# EAGLE design motor_controller (EAGLE 9.3.0)
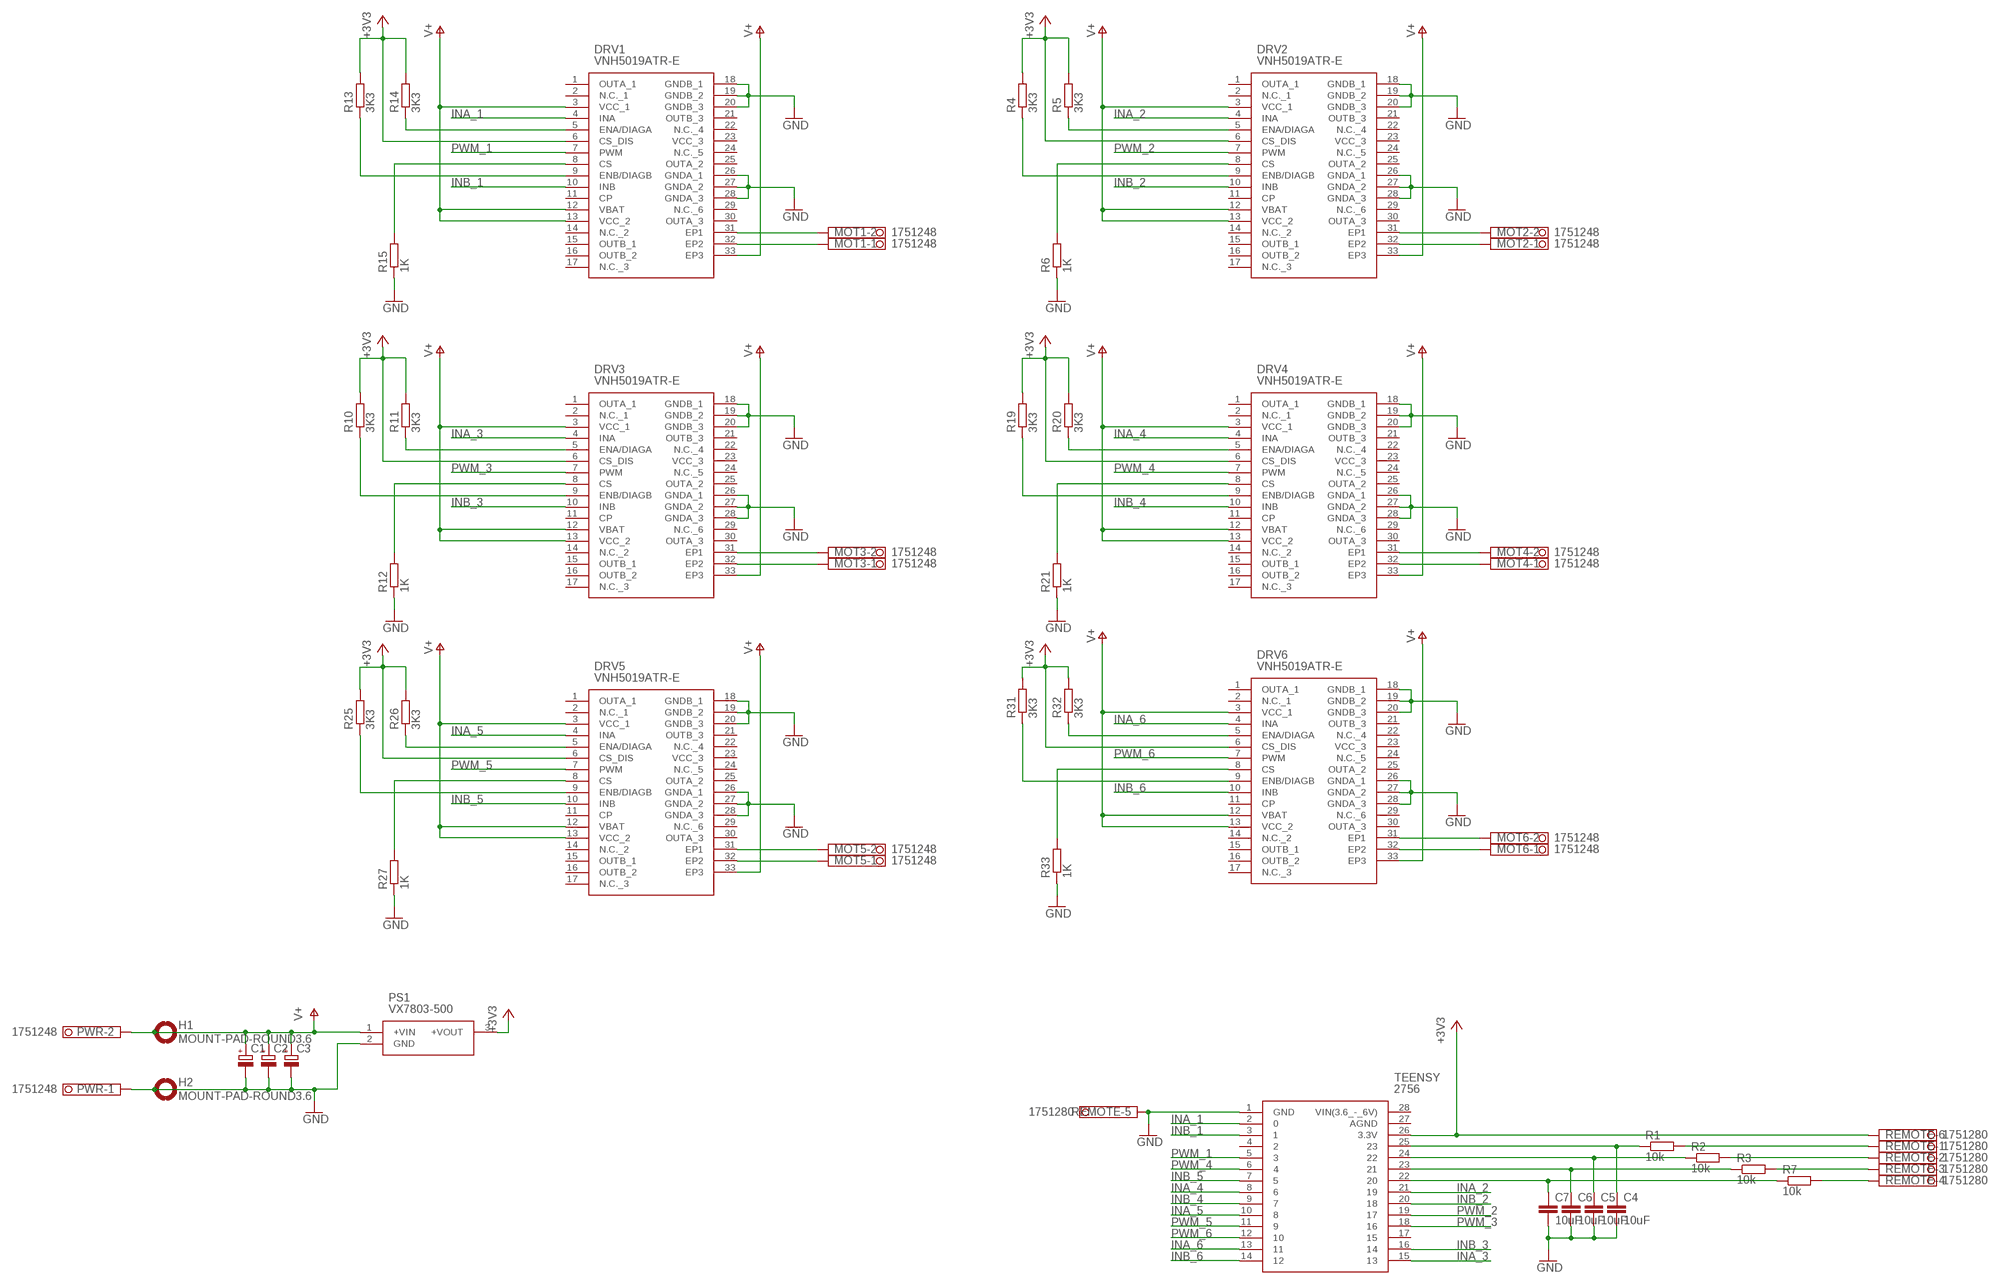
[diagram p0: schematic, sheet 1]

## Parts
C1  CPOL-EUE10-20  [EB20D]
C2  CPOL-EUE10-20  [EB20D]
C3  CPOL-EUE10-20  [EB20D]
C4  10uF  C-EUC0603  [C0603]
C5  10uF  C-EUC0603  [C0603]
C6  10uF  C-EUC0603  [C0603]
C7  10uF  C-EUC0603  [C0603]
DRV1  VNH5019ATR-E  [VNH5019A-E_1]
DRV2  VNH5019ATR-E  [VNH5019A-E_1]
DRV3  VNH5019ATR-E  [VNH5019A-E_1]
DRV4  VNH5019ATR-E  [VNH5019A-E_1]
DRV5  VNH5019ATR-E  [VNH5019A-E_1]
DRV6  VNH5019ATR-E  [VNH5019A-E_1]
H1  MOUNT-PAD-ROUND3.6  [3,6-PAD]
H2  MOUNT-PAD-ROUND3.6  [3,6-PAD]
MOT1  1751248  [1751248]
MOT2  1751248  [1751248]
MOT3  1751248  [1751248]
MOT4  1751248  [1751248]
MOT5  1751248  [1751248]
MOT6  1751248  [1751248]
PS1  VX7803-500  VX7805-500  [VX7805500]
PWR  1751248  [1751248]
R1  10k  R-EU_R0603  [R0603]
R2  10k  R-EU_R0603  [R0603]
R3  10k  R-EU_R0603  [R0603]
R4  3K3  R-EU_R0603  [R0603]
R5  3K3  R-EU_R0603  [R0603]
R6  1K  R-EU_R0603  [R0603]
R7  10k  R-EU_R0603  [R0603]
R10  3K3  R-EU_R0603  [R0603]
R11  3K3  R-EU_R0603  [R0603]
R12  1K  R-EU_R0603  [R0603]
R13  3K3  R-EU_R0603  [R0603]
R14  3K3  R-EU_R0603  [R0603]
R15  1K  R-EU_R0603  [R0603]
R19  3K3  R-EU_R0603  [R0603]
R20  3K3  R-EU_R0603  [R0603]
R21  1K  R-EU_R0603  [R0603]
R25  3K3  R-EU_R0603  [R0603]
R26  3K3  R-EU_R0603  [R0603]
R27  1K  R-EU_R0603  [R0603]
R31  3K3  R-EU_R0603  [R0603]
R32  3K3  R-EU_R0603  [R0603]
R33  1K  R-EU_R0603  [R0603]
REMOTE  1751280  [1751280]
TEENSY  2756  [DIP1500W100P250L3500H700Q28N]

## Nets
+3V3: DRV1.6(CS_DIS) DRV2.6(CS_DIS) DRV3.6(CS_DIS) DRV4.6(CS_DIS) DRV5.6(CS_DIS) DRV6.6(CS_DIS) PS1.3(+VOUT) R4.2 R5.2 R10.2 R11.2 R13.2 R14.2 R19.2 R20.2 R25.2 R26.2 R31.2 R32.2 REMOTE.6 TEENSY.26(3.3V)
GND: C1.- C2.- C3.- C4.2 C5.2 C6.2 C7.2 DRV1.18(GNDB_1) DRV1.19(GNDB_2) DRV1.20(GNDB_3) DRV1.26(GNDA_1) DRV1.27(GNDA_2) DRV1.28(GNDA_3) DRV2.18(GNDB_1) DRV2.19(GNDB_2) DRV2.20(GNDB_3) DRV2.26(GNDA_1) DRV2.27(GNDA_2) DRV2.28(GNDA_3) DRV3.18(GNDB_1) DRV3.19(GNDB_2) DRV3.20(GNDB_3) DRV3.26(GNDA_1) DRV3.27(GNDA_2) DRV3.28(GNDA_3) DRV4.18(GNDB_1) DRV4.19(GNDB_2) DRV4.20(GNDB_3) DRV4.26(GNDA_1) DRV4.27(GNDA_2) DRV4.28(GNDA_3) DRV5.18(GNDB_1) DRV5.19(GNDB_2) DRV5.20(GNDB_3) DRV5.26(GNDA_1) DRV5.27(GNDA_2) DRV5.28(GNDA_3) DRV6.18(GNDB_1) DRV6.19(GNDB_2) DRV6.20(GNDB_3) DRV6.26(GNDA_1) DRV6.27(GNDA_2) DRV6.28(GNDA_3) H2.B3,6(MOUNT) PS1.2(GND) PWR.1 R6.1 R12.1 R15.1 R21.1 R27.1 R33.1 REMOTE.5 TEENSY.1(GND)
INA_1: DRV1.4(INA) TEENSY.2
INA_2: DRV2.4(INA) TEENSY.21
INA_3: DRV3.4(INA) TEENSY.15
INA_4: DRV4.4(INA) TEENSY.8
INA_5: DRV5.4(INA) TEENSY.10
INA_6: DRV6.4(INA) TEENSY.13
INB_1: DRV1.10(INB) TEENSY.3
INB_2: DRV2.10(INB) TEENSY.20
INB_3: DRV3.10(INB) TEENSY.16
INB_4: DRV4.10(INB) TEENSY.9
INB_5: DRV5.10(INB) TEENSY.7
INB_6: DRV6.10(INB) TEENSY.14
N$1: C4.1 R1.1 TEENSY.25
N$2: C5.1 R2.1 TEENSY.24
N$3: C6.1 R3.1 TEENSY.23
N$4: C7.1 R7.1 TEENSY.22
N$5: R1.2 REMOTE.1
N$6: DRV2.5(ENA/DIAGA) R5.1
N$7: DRV2.9(ENB/DIAGB) R4.1
N$8: DRV2.8(CS) R6.2
N$9: DRV2.31(EP1) MOT2.2
N$10: DRV2.32(EP2) MOT2.1
N$11: R2.2 REMOTE.2
N$12: R3.2 REMOTE.3
N$13: R7.2 REMOTE.4
N$16: DRV3.5(ENA/DIAGA) R11.1
N$17: DRV3.9(ENB/DIAGB) R10.1
N$18: DRV3.8(CS) R12.2
N$19: DRV3.31(EP1) MOT3.2
N$20: DRV3.32(EP2) MOT3.1
N$21: DRV1.5(ENA/DIAGA) R14.1
N$22: DRV1.9(ENB/DIAGB) R13.1
N$23: DRV1.8(CS) R15.2
N$24: DRV1.31(EP1) MOT1.2
N$25: DRV1.32(EP2) MOT1.1
N$31: DRV4.5(ENA/DIAGA) R20.1
N$32: DRV4.9(ENB/DIAGB) R19.1
N$33: DRV4.8(CS) R21.2
N$34: DRV4.31(EP1) MOT4.2
N$35: DRV4.32(EP2) MOT4.1
N$41: DRV5.5(ENA/DIAGA) R26.1
N$42: DRV5.9(ENB/DIAGB) R25.1
N$43: DRV5.8(CS) R27.2
N$44: DRV5.31(EP1) MOT5.2
N$45: DRV5.32(EP2) MOT5.1
N$51: DRV6.5(ENA/DIAGA) R32.1
N$52: DRV6.9(ENB/DIAGB) R31.1
N$53: DRV6.8(CS) R33.2
N$54: DRV6.31(EP1) MOT6.2
N$55: DRV6.32(EP2) MOT6.1
PWM_1: DRV1.7(PWM) TEENSY.5
PWM_2: DRV2.7(PWM) TEENSY.19
PWM_3: DRV3.7(PWM) TEENSY.18
PWM_4: DRV4.7(PWM) TEENSY.6
PWM_5: DRV5.7(PWM) TEENSY.11
PWM_6: DRV6.7(PWM) TEENSY.12
V+: C1.+ C2.+ C3.+ DRV1.3(VCC_1) DRV1.12(VBAT) DRV1.13(VCC_2) DRV1.33(EP3) DRV2.3(VCC_1) DRV2.12(VBAT) DRV2.13(VCC_2) DRV2.33(EP3) DRV3.3(VCC_1) DRV3.12(VBAT) DRV3.13(VCC_2) DRV3.33(EP3) DRV4.3(VCC_1) DRV4.12(VBAT) DRV4.13(VCC_2) DRV4.33(EP3) DRV5.3(VCC_1) DRV5.12(VBAT) DRV5.13(VCC_2) DRV5.33(EP3) DRV6.3(VCC_1) DRV6.12(VBAT) DRV6.13(VCC_2) DRV6.33(EP3) H1.B3,6(MOUNT) PS1.1(+VIN) PWR.2
Unconnected: DRV1.1(OUTA_1) DRV1.2(N.C._1) DRV1.11(CP) DRV1.14(N.C._2) DRV1.15(OUTB_1) DRV1.16(OUTB_2) DRV1.17(N.C._3) DRV1.21(OUTB_3) DRV1.22(N.C._4) DRV1.23(VCC_3) DRV1.24(N.C._5) DRV1.25(OUTA_2) DRV1.29(N.C._6) DRV1.30(OUTA_3) DRV2.1(OUTA_1) DRV2.2(N.C._1) DRV2.11(CP) DRV2.14(N.C._2) DRV2.15(OUTB_1) DRV2.16(OUTB_2) DRV2.17(N.C._3) DRV2.21(OUTB_3) DRV2.22(N.C._4) DRV2.23(VCC_3) DRV2.24(N.C._5) DRV2.25(OUTA_2) DRV2.29(N.C._6) DRV2.30(OUTA_3) DRV3.1(OUTA_1) DRV3.2(N.C._1) DRV3.11(CP) DRV3.14(N.C._2) DRV3.15(OUTB_1) DRV3.16(OUTB_2) DRV3.17(N.C._3) DRV3.21(OUTB_3) DRV3.22(N.C._4) DRV3.23(VCC_3) DRV3.24(N.C._5) DRV3.25(OUTA_2) DRV3.29(N.C._6) DRV3.30(OUTA_3) DRV4.1(OUTA_1) DRV4.2(N.C._1) DRV4.11(CP) DRV4.14(N.C._2) DRV4.15(OUTB_1) DRV4.16(OUTB_2) DRV4.17(N.C._3) DRV4.21(OUTB_3) DRV4.22(N.C._4) DRV4.23(VCC_3) DRV4.24(N.C._5) DRV4.25(OUTA_2) DRV4.29(N.C._6) DRV4.30(OUTA_3) DRV5.1(OUTA_1) DRV5.2(N.C._1) DRV5.11(CP) DRV5.14(N.C._2) DRV5.15(OUTB_1) DRV5.16(OUTB_2) DRV5.17(N.C._3) DRV5.21(OUTB_3) DRV5.22(N.C._4) DRV5.23(VCC_3) DRV5.24(N.C._5) DRV5.25(OUTA_2) DRV5.29(N.C._6) DRV5.30(OUTA_3) DRV6.1(OUTA_1) DRV6.2(N.C._1) DRV6.11(CP) DRV6.14(N.C._2) DRV6.15(OUTB_1) DRV6.16(OUTB_2) DRV6.17(N.C._3) DRV6.21(OUTB_3) DRV6.22(N.C._4) DRV6.23(VCC_3) DRV6.24(N.C._5) DRV6.25(OUTA_2) DRV6.29(N.C._6) DRV6.30(OUTA_3) TEENSY.4 TEENSY.17

## Power pins joined to a net without a drawn wire
AGND: TEENSY.27(AGND)
VIN(3.6_-_6V): TEENSY.28(VIN(3.6_-_6V))

## Library data of the parts
C1-C3 = rcl:CPOL-EU: POLARIZED CAPACITOR, European symbol; SPICEPREFIX: C
C4-C7 = rcl:C-EU: CAPACITOR, European symbol; SPICEPREFIX: C
DRV1-DRV6 = SamacSys_Parts:VNH5019ATR-E: STMicroelectronics VNH5019ATR-E, Brushed Motor Driver IC, 41 V 30A 30-Pin, MultiPowerSO Source: Datasheet <https://www.st.com/resource/en/datasheet/vnh5019a-e.pdf>; DESCRIPTION: STMicroelectronics VNH5019ATR-E, Brushed Motor Driver IC, 41 V 30A 30-Pin, MultiPowerSO; HEIGHT: mm; MANUFACTURER_NAME: STMicroelectronics; MANUFACTURER_PART_NUMBER: VNH5019ATR-E; MOUSER_PART_NUMBER: 511-VNH5019ATR-E; MOUSER_PRICE-STOCK: https://www.mouser.com/Search/Refine.aspx?Keyword=511-VNH5019ATR-E; RS_PART_NUMBER: 1106608P; RS_PRICE-STOCK: http://uk.rs-online.com/web/p/products/1106608P
H1 H2 = holes:MOUNT-PAD-ROUND: MOUNTING PAD, round
MOT1-MOT6 PWR = con-phoenix-350:1751248: MKDS 1/ 2-3,5 Printklemme Nennstrom: 10 A Bemessungsspannung: 160 V Raster: 3,5 mm Polzahl: 2 Montageart: Löten Anschlussart: Schraubanschluss Anschlussrichtung vom Leiter zur Platine: 0° Source: http://eshop.phoenixcontact.com .. 1751248.pdf; OC_FARNELL: unknown; OC_NEWARK: unknown
PS1 = SamacSys_Parts:VX7805-500: Non-Isolated DC/DC Converters 6.5-36Vin 5Vout 0.5A 2.5W SIP non-Iso Source: Datasheet <https://www.cui.com/product/resource/vx78-500.pdf>; DESCRIPTION: Non-Isolated DC/DC Converters 6.5-36Vin 5Vout 0.5A 2.5W SIP non-Iso; HEIGHT: 10mm; MANUFACTURER_NAME: CUI; MANUFACTURER_PART_NUMBER: VX7805-500; MOUSER_PART_NUMBER: 490-VX7805-500; MOUSER_PRICE-STOCK: https://www.mouser.com/Search/Refine.aspx?Keyword=490-VX7805-500
R1-R7 R10-R15 R19-R21 R25-R27 R31-R33 = rcl:R-EU_: RESISTOR, European symbol; SPICEPREFIX: R
REMOTE = con-phoenix-350:1751280: MKDS 1/ 6-3,5 Printklemme Nennstrom: 10 A Bemessungsspannung: 160 V Raster: 3,5 mm Polzahl: 6 Montageart: Löten Anschlussart: Schraubanschluss Anschlussrichtung vom Leiter zur Platine: 0° Source: http://eshop.phoenixcontact.com .. 1751280.pdf; MPN: 1751280; OC_FARNELL: unknown; OC_NEWARK: 27R1765
TEENSY = SamacSys_Parts:2756: Teensy 3.2 ARM Cortex-M4 Dev Board Source: Datasheet <https://media.digikey.com/pdf/Data Sheets/Sparkfun PDFs/DEV-13736_Web.pdf>; ALLIED_NUMBER: 70929283; ALLIED_PRICE-STOCK: https://www.alliedelec.com/adafruit-industries-2756/70929283/; DESCRIPTION: Teensy 3.2 ARM Cortex-M4 Dev Board; HEIGHT: 7mm; MANUFACTURER_NAME: Adafruit; MANUFACTURER_PART_NUMBER: 2756; MOUSER_PART_NUMBER: 485-2756; MOUSER_PRICE-STOCK: https://www.mouser.com/Search/Refine.aspx?Keyword=485-2756; RS_PART_NUMBER: 1245510; RS_PRICE-STOCK: http://uk.rs-online.com/web/p/products/1245510

## Board
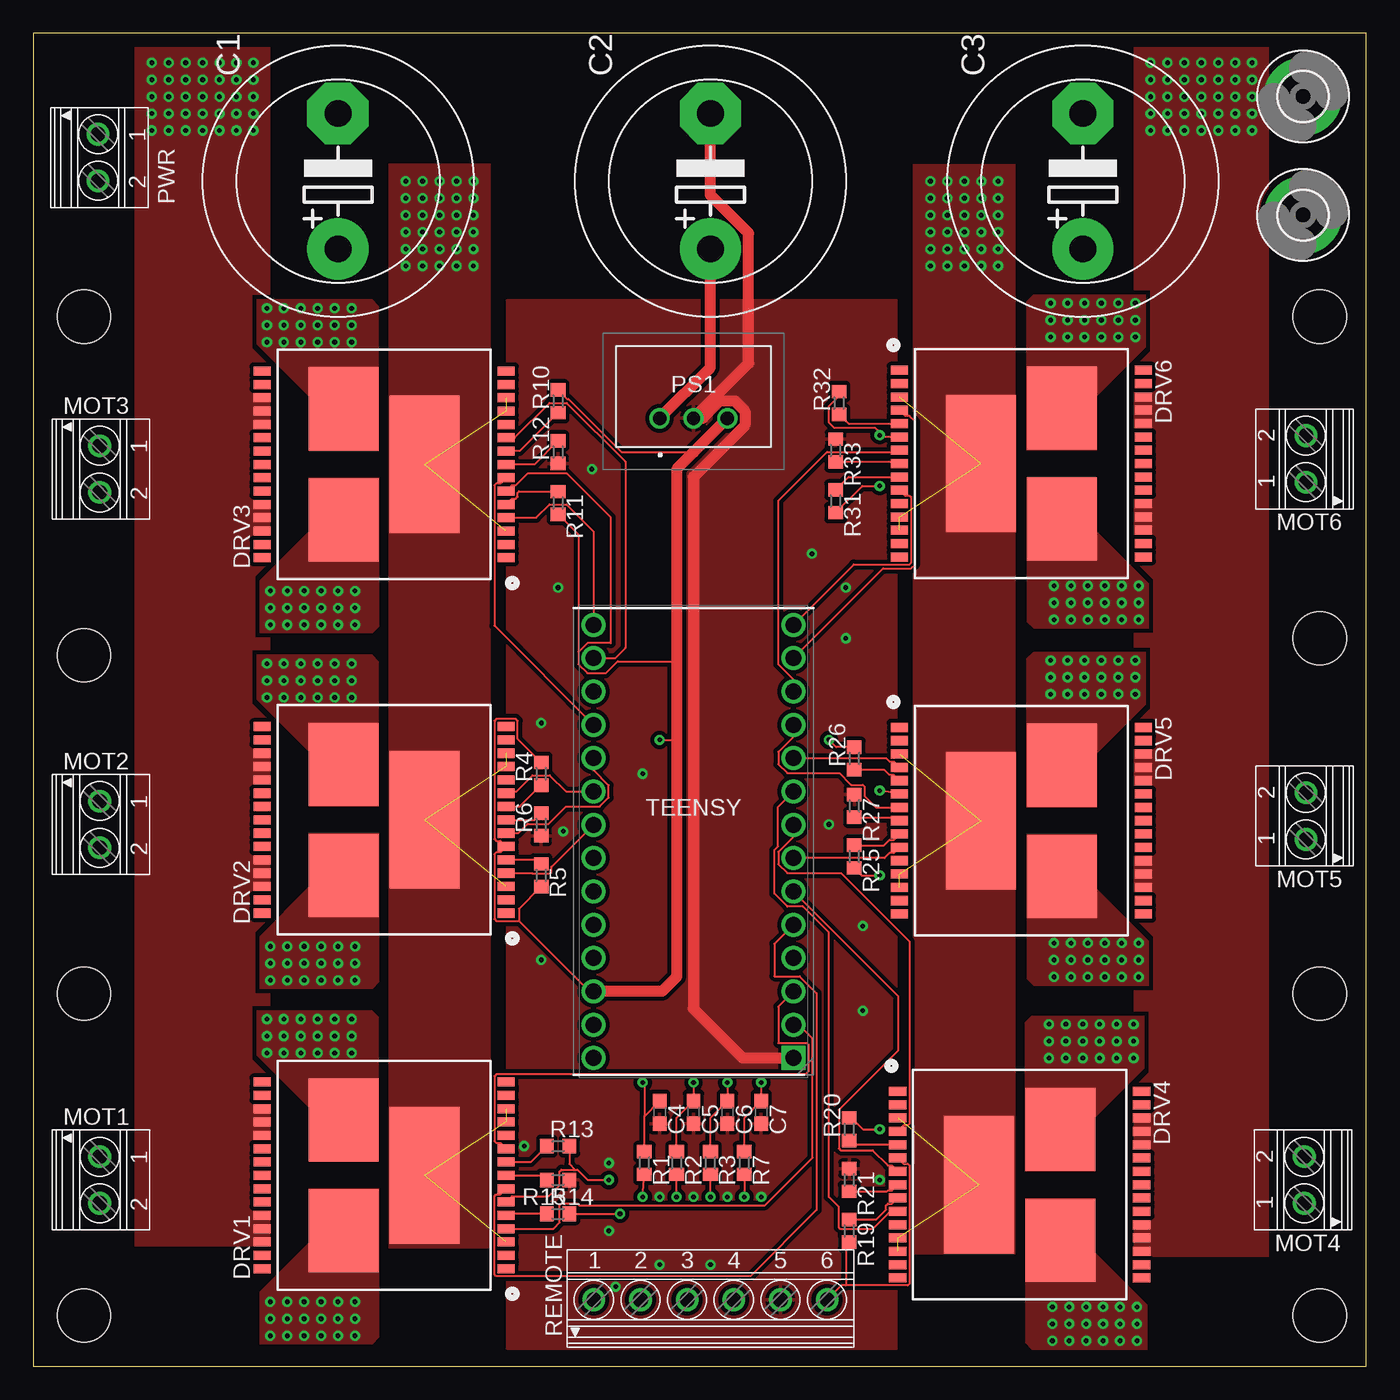
[diagram p1: board, top side]
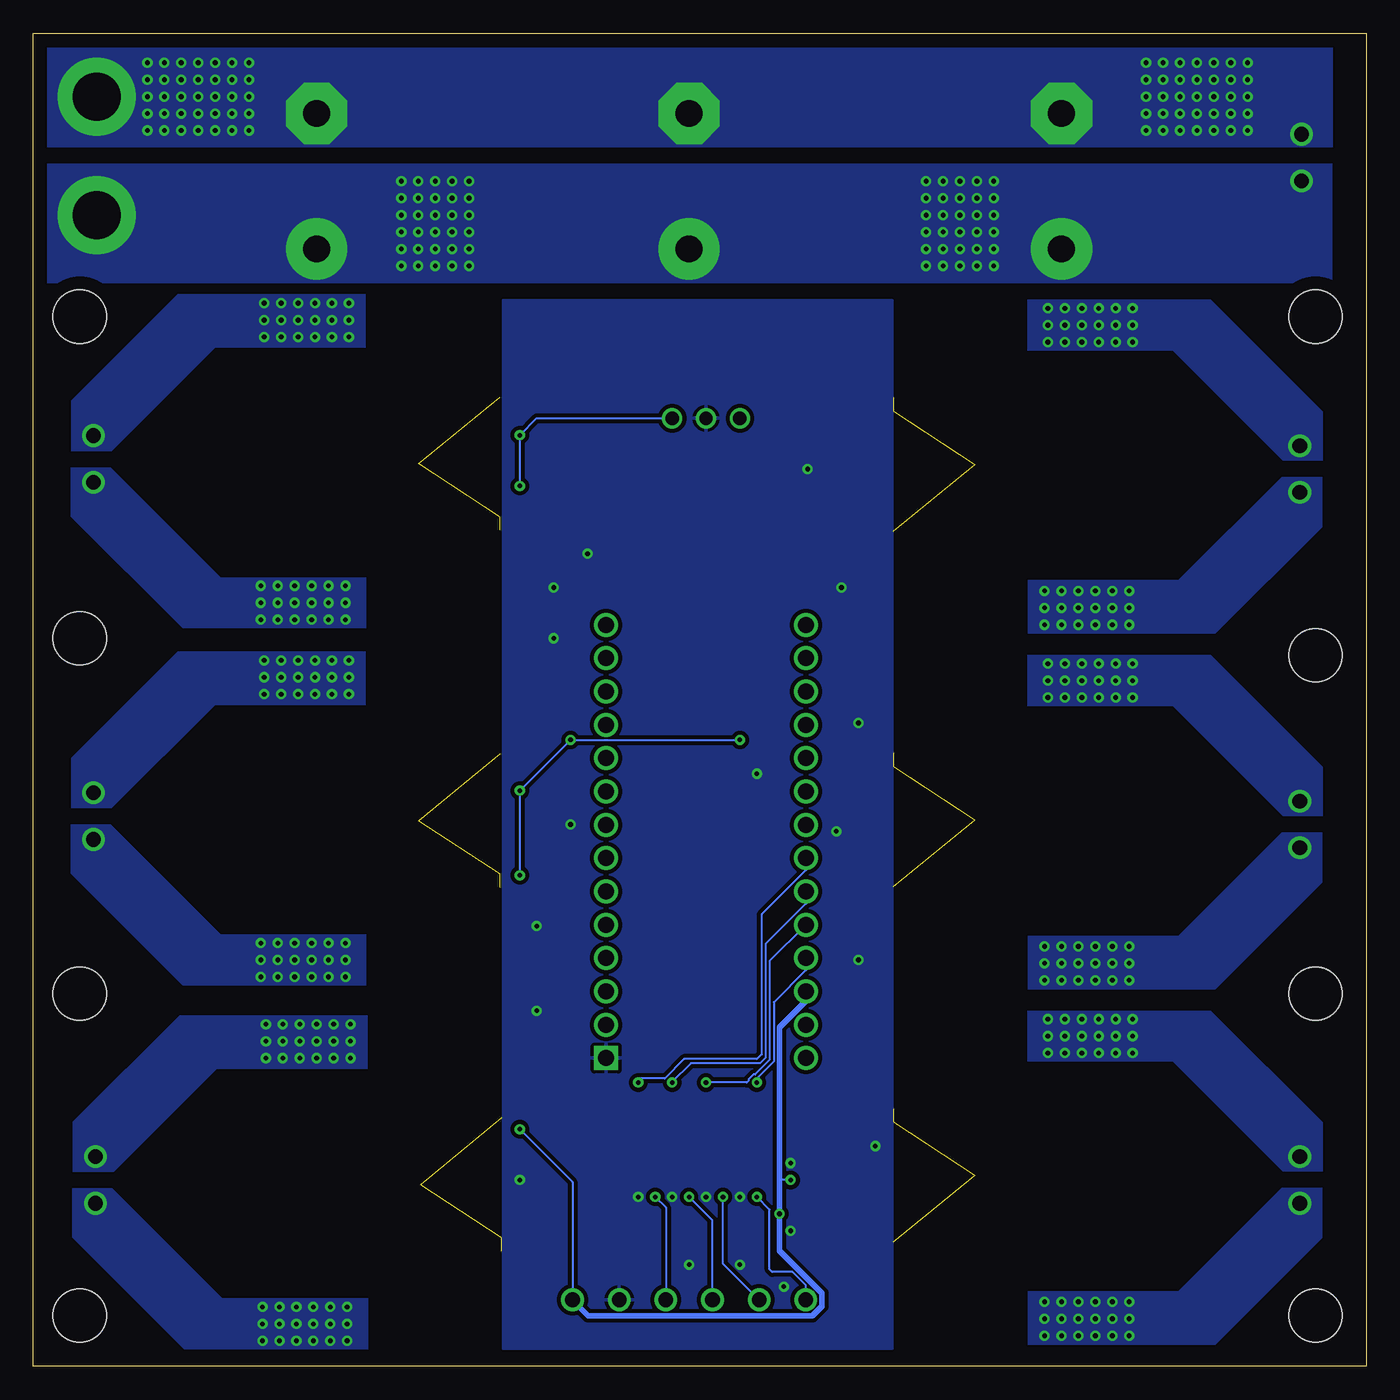
[diagram p2: board, bottom side, seen from below]

Size 100 x 100 mm. Coordinates in mm from the lower left corner, seen from the top.
Outline: 0,0 100,0 100,100 0,100 0,0
Copper layers (1*16): Top 0.035mm / dielectric 1.5mm / Bottom 0.035mm
Design rules "default": minimum track width 6mil, minimum drill 0.35mm, track to track 6mil, track to pad 6mil, pad to pad 6mil, via to via 6mil, smd to smd 6mil, copper to edge 40mil, drill to drill 6mil, minimum pad ring 10mil, minimum via ring 8mil, stop-mask expansion 4mil, vias tented up to drill 0mil, thermal gap 10mil
Holes 4 mm at 3.81,3.81 96.52,3.81 96.52,27.94 96.52,54.61 96.52,78.74 3.81,78.74 3.81,53.34 3.81,27.94

### Footprints (pad centres in the part's own frame; a part is rotated, then mirrored left to right if it is on the bottom)
EB20D = drill 2.007 pad 4.597: + -5.08,0 | drill 2.007 pad 4.597 octagon: - 5.08,0
C0603 = smd 1.1 x 1: 1 -0.85,0; 2 0.85,0
VNH5019A-E_1 = smd 0.68 x 1.3: 1 -13,-15.15; 2 -12,-15.15; 3 -11,-15.15; 4 -10,-15.15; 5 -9,-15.15; 6 -8,-15.15; 7 -7,-15.15; 8 -6,-15.15; 9 -5,-15.15; 10 -4,-15.15; 11 -3,-15.15; 12 -2,-15.15; 13 -1,-15.15; 14 0,-15.15; 15 1,-15.15; 16 1,3.15; 17 0,3.15; 18 -1,3.15; 19 -2,3.15; 20 -3,3.15; 21 -4,3.15; 22 -5,3.15; 23 -6,3.15; 24 -7,3.15; 25 -8,3.15; 26 -9,3.15; 27 -10,3.15; 28 -11,3.15; 29 -12,3.15; 30 -13,3.15 | smd 6.23 x 5.25: 31 -10.165,-2.95; 32 -1.835,-2.95 | smd 10.3 x 5.25: 33 -6,-9.05
3,6-PAD = drill 3.6 pad 5.842: B3,6 0,0
1751248 = drill 1.1 pad 1.7: 1 -1.75,-0.1; 2 1.75,-0.1
VX7805500 = drill 1 pad 1.5: 1 -2.54,-1.275; 2 0,-1.275; 3 2.54,-1.275
R0603 = smd 1 x 1.1: 1 -0.85,0; 2 0.85,0
1751280 = drill 1.1 pad 1.7: 1 -8.75,-0.1; 2 -5.25,-0.1; 3 -1.75,-0.1; 4 1.75,-0.1; 5 5.25,-0.1; 6 8.75,-0.1
DIP1500W100P250L3500H700Q28N = drill 1.2 pad 1.6 square: 1 -7.5,16.25 | drill 1.2 pad 1.6: 2 -7.5,13.75; 3 -7.5,11.25; 4 -7.5,8.75; 5 -7.5,6.25; 6 -7.5,3.75; 7 -7.5,1.25; 8 -7.5,-1.25; 9 -7.5,-3.75; 10 -7.5,-6.25; 11 -7.5,-8.75; 12 -7.5,-11.25; 13 -7.5,-13.75; 14 -7.5,-16.25; 15 7.5,-16.25; 16 7.5,-13.75; 17 7.5,-11.25; 18 7.5,-8.75; 19 7.5,-6.25; 20 7.5,-3.75; 21 7.5,-1.25; 22 7.5,1.25; 23 7.5,3.75; 24 7.5,6.25; 25 7.5,8.75; 26 7.5,11.25; 27 7.5,13.75; 28 7.5,16.25

### Placement (x,y rotation side)
C1  22.86,88.9 90 top
C2  50.8,88.9 90 top
C3  78.74,88.9 90 top
C4  46.99,19.05 270 top
C5  49.53,19.05 270 top
C6  52.07,19.05 270 top
C7  54.61,19.05 270 top
DRV1  20.32,20.32 90 top
DRV2  20.32,46.99 90 top
DRV3  20.32,73.66 90 top
DRV4  80.01,7.62 270 top
DRV5  80.14,34.92 270 top
DRV6  80.14,61.72 270 top
H1  95.25,86.36 0 top
H2  95.25,95.25 0 top
MOT1  5.08,13.97 270 top
MOT2  5.08,40.64 270 top
MOT3  5.08,67.31 270 top
MOT4  95.25,13.97 90 top
MOT5  95.38,41.27 90 top
MOT6  95.38,68.07 90 top
PS1  49.53,72.39 0 top
PWR  4.95,90.68 270 top
R1  45.85,15.24 270 top
R2  48.26,15.24 270 top
R3  50.8,15.24 270 top
R4  38.1,44.45 90 top
R5  38.1,36.83 270 top
R6  38.1,40.64 90 top
R7  53.34,15.24 270 top
R10  39.37,72.39 90 top
R11  39.37,64.77 270 top
R12  39.37,68.58 90 top
R13  39.37,16.51 0 top
R14  39.37,11.43 0 top
R15  39.37,13.97 180 top
R19  61.21,10.16 270 top
R20  61.21,17.78 90 top
R21  61.21,13.97 270 top
R25  61.59,38.23 270 top
R26  61.59,45.59 90 top
R27  61.59,42.04 270 top
R31  60.2,64.9 270 top
R32  60.45,72.26 90 top
R33  60.2,68.71 270 top
REMOTE  50.8,5.08 0 top
TEENSY  49.53,39.37 180 top

### Tracks (layer width: path | path; a pad name or v marks a point on that pad's centre or on a via)
+3V3  (via drill 0.35)
  Top 0.152: 48.26,52.07 48.26,52.87 43.85,52.87 42.97,51.99 41.56,51.99 40.9,52.65 40.9,53.59 | 40.9,53.59 41.56,54.25 43.32,54.25 43.32,63.7 40.02,67 37.12,67 36.22,66.09 35.9,66.09 DRV3.6 | DRV6.6 63.63,69.72 v63.5,69.85 63.5,70.06 63.15,70.42 60.08,70.42 59.67,70.82 59.67,72.01 60.45,72.79 R32.2 | 36.43,33.42 34.73,33.42 34.59,33.55 34.59,38.42 34.73,38.56 35.04,38.56 DRV2.6 35.04,39.42 34.73,39.42 34.59,39.55 34.59,48.42 34.73,48.56 36.22,48.56 36.35,48.42 36.35,47.05 R4.2 | 36.43,33.42 41.91,27.94 41.91,28 TEENSY.26 | DRV5.6 v63.5,43.18 | v46.99,46.99 48.26,46.99 | DRV4.6 65.29,15.19 65.61,15.19 65.74,15.05 65.74,6.18 65.61,6.05 60.96,6.05 | REMOTE.6 60.62,6.05 60.96,6.05 | DRV1.6 35.9,12.75 38.67,12.75 39.49,13.57 39.49,14.62 39.62,14.75 40.64,14.75 | 40.64,14.75 40.81,14.75 41.59,13.97 v43.18,13.97 | R10.2 40.04,72.57 40.14,72.57 44.14,68.58 49.53,68.58 | R11.2 40.9,62.39 40.9,53.59 | R31.2 62.19,66.04 v63.5,66.04 | R25.2 62.14,36.83 v63.5,36.83 | R26.2 60.24,46.44 v59.69,46.99 | R20.2 61.38,18.63 62.23,17.78 v63.5,17.78 | R19.2 60.96,9.06 60.96,6.05 | R14.2 v44.02,11.43 | R13.2 40.22,15.17 40.64,14.75 | R5.2 36.43,34.31 36.43,33.42
  Top 0.813: PS1.3 49.53,68.58 48.26,67.31 48.26,52.07 48.26,46.99 48.26,29.21 47.17,28.12 TEENSY.26
  Bottom 0.152: PS1.3 62.23,71.11 v63.5,69.85 v63.5,66.04 | v46.99,46.99 v59.69,46.99 v63.5,43.18 v63.5,36.83 | v43.18,13.97 44.02,13.97 | v63.5,17.78 59.55,13.83 REMOTE.6
  Bottom 0.406: REMOTE.6 58.36,3.77 41.55,3.77 40.84,4.48 40.84,5.48 44.02,8.65 v44.02,11.43 44.02,13.97 44.02,25.41 42.03,27.4 TEENSY.26
GND  (via drill 0.35, 0.35 pad 0.03)
  Top 0.813: C2.- 50.8,87.86 53.66,85 53.66,75.24 PS1.2 50.21,71.11 51.53,72.43 52.61,72.43 53.38,71.66 53.38,70.57 49.53,66.72 49.53,26.81 53.22,23.12 TEENSY.1
  other vias: 8.89,97.79 8.89,96.52 8.89,95.25 8.89,93.98 8.89,92.71 10.16,97.79 10.16,96.52 10.16,95.25 10.16,93.98 10.16,92.71 11.43,97.79 11.43,96.52 11.43,95.25 11.43,93.98 11.43,92.71 12.7,97.79 12.7,96.52 12.7,95.25 12.7,93.98 12.7,92.71 13.97,97.79 13.97,96.52 13.97,95.25 13.97,93.98 13.97,92.71 15.24,97.79 15.24,96.52 15.24,95.25 15.24,93.98 15.24,92.71 16.51,97.79 16.51,96.52 16.51,95.25 16.51,93.98 16.51,92.71 83.82,97.79 83.82,96.52 83.82,95.25 83.82,93.98 83.82,92.71 85.09,97.79 85.09,96.52 85.09,95.25 85.09,93.98 85.09,92.71 86.36,97.79 86.36,96.52 86.36,95.25 86.36,93.98 86.36,92.71 87.63,97.79 87.63,96.52 87.63,95.25 87.63,93.98 87.63,92.71 88.9,97.79 88.9,96.52 88.9,95.25 88.9,93.98 88.9,92.71 90.17,97.79 90.17,96.52 90.17,95.25 90.17,93.98 90.17,92.71 91.44,97.79 91.44,96.52 91.44,95.25 91.44,93.98 91.44,92.71 45.72,44.45 62.23,26.67 62.23,33.02 59.69,40.64 39.37,58.42 58.42,60.96 60.96,58.42 60.96,54.61 38.1,30.48 38.1,48.26 43.18,10.16 43.18,15.24 54.61,12.7 36.83,16.51 41.91,67.31 39.75,40.13 46.99,12.7 43.69,5.97 46.99,7.62 50.8,7.62 63.5,13.97 49.53,12.7 52.07,12.7
  pour Top (isolate 0.305, rank 2, no thermals): 17.78,9.02 17.78,99.22 7.62,99.22 7.62,9.02
  pour Top (isolate 0.305, rank 2, no thermals): 82.55,8.26 92.71,8.26 92.71,99.06 82.55,99.06
  pour Bottom (isolate 0.305, rank 2, no thermals): 2.54,91.44 99.06,91.44 99.06,99.06 2.54,99.06
  pour Top (isolate 0.305, rank 3): 35.56,80.01 64.77,80.01 64.77,1.27 35.56,1.27
  pour Bottom (isolate 0.305, rank 3): 64.77,80.01 35.56,80.01 35.56,1.27 64.77,1.27
INA_1
  Top 0.152: DRV1.4 39.03,10.32 39.49,10.79 39.49,12.07 39.62,12.21 40.81,12.21 40.95,12.07 54.9,12.07 58.46,15.64 58.46,24.61 57.45,25.62 TEENSY.2
INA_2
  Top 0.152: DRV2.4 37.42,36.99 37.45,36.95 38.74,36.95 38.88,37.09 38.88,37.47 TEENSY.21
INA_3
  Top 0.152: DRV3.4 37.74,63.66 38.73,64.65 40.02,64.65 42.03,62.63 TEENSY.15
INA_4
  Top 0.152: DRV4.4 65.29,18.05 65.61,18.05 65.74,18.18 65.74,31.86 60.61,36.99 56.56,36.99 55.9,37.65 55.9,38.59 57.03,39.72 TEENSY.8
INA_5
  Top 0.152: DRV5.4 64.56,45.36 64.24,45.36 63.98,45.62 TEENSY.10
INA_6
  Top 0.152: TEENSY.13 63.76,59.85 65.86,59.85 66.17,60.16 66.17,70.85 65.73,71.29 65.42,71.29 DRV6.4
INB_1
  Top 0.152: TEENSY.3 55.9,26.99 55.9,24.25 58.02,24.25 58.16,24.11 58.16,22.12 57.92,21.89 34.73,21.89 34.59,21.75 34.59,16.89 34.73,16.75 35.04,16.75 DRV1.10
INB_2
  Top 0.152: DRV2.10 35.6,43.12 36.25,43.12 37.45,44.33 38.74,44.33 39.95,43.12 TEENSY.20
INB_3
  Top 0.152: TEENSY.16 43.67,53.12 44.43,53.88 44.43,67.86 40.02,72.27 38.73,72.27 36.12,69.66 DRV3.10
INB_4
  Top 0.152: DRV4.10 64.29,11.62 62.95,10.28 60.57,10.28 60.44,10.41 60.44,11.96 59.69,12.7 59.69,32.53 57.73,34.49 56.56,34.49 55.6,35.46 55.6,38.71 55.88,39 55.88,41.97 TEENSY.9
INB_5
  Top 0.152: DRV5.10 64.56,38.49 64.24,38.49 63.87,38.12 TEENSY.7
INB_6
  Top 0.152: DRV6.10 65.42,65.29 65.73,65.29 65.87,65.16 65.87,60.29 65.73,60.15 61.56,60.15 TEENSY.14
N$1  (via drill 0.35)
  Top 0.152: R1.1 45.85,18.76 | 45.85,18.76 C4.1 | v45.72,21.28 45.85,21.16 45.85,18.76
  Bottom 0.152: TEENSY.25 42.03,29.72 44.45,27.3 44.45,22.86 45.72,21.59 v45.72,21.28
N$2  (via drill 0.35)
  Top 0.152: R2.1 48.26,18.63 C5.1 v49.53,21.28
  Bottom 0.152: TEENSY.24 44.76,30.39 44.76,22.99 45.85,21.89 45.97,21.89 46.33,21.53 46.33,21.41 46.46,21.28 v49.53,21.28
N$3  (via drill 0.35)
  Top 0.152: R3.1 50.8,18.63 C6.1 v52.07,21.28
  Bottom 0.152: TEENSY.23 42.03,34.72 45.06,31.69 45.06,23.14 45.47,22.73 50.67,22.73 52.07,21.34 v52.07,21.28
N$4  (via drill 0.35)
  Top 0.152: R7.1 53.34,18.63 C7.1 v54.61,21.28
  Bottom 0.152: TEENSY.22 42.03,37.22 45.36,33.88 45.36,23.39 45.72,23.04 51.17,23.04 52.62,21.59 54.61,21.59 v54.61,21.28
N$5  (via drill 0.35)
  Top 0.152: v45.72,12.7 R1.2
  Bottom 0.152: REMOTE.1 42.05,6.07 43.05,7.08 44.58,7.08 44.76,7.25 44.76,11.73 v45.72,12.7
N$6
  Top 0.152: R5.1 37.79,37.99 DRV2.5
N$7
  Top 0.152: DRV2.9 36.49,41.99 R4.1
N$8
  Top 0.152: DRV2.8 37.6,40.99 R6.2
N$9  (via drill 0.35 pad 0.03)
  other vias: 20.32,30.23 19.05,30.23 17.78,30.23 21.59,30.23 22.86,30.23 24.13,30.23 20.32,31.5 19.05,31.5 17.78,31.5 21.59,31.5 22.86,31.5 24.13,31.5 20.32,28.96 19.05,28.96 17.78,28.96 21.59,28.96 22.86,28.96 24.13,28.96
  pour Bottom (no thermals): 3.3,40.01 6.35,40.01 14.1,32.26 25.4,32.26 25.4,28.32 11.3,28.32 3.3,36.32
  pour Top (no thermals): 20.7,40.01 25.91,40.01 25.91,28.83 25.4,28.32 17.02,28.32 17.02,32.26 20.7,35.94
N$10  (via drill 0.35 pad 0.03)
  other vias: 21.34,50.16 20.07,50.16 18.8,50.16 17.53,50.16 22.61,50.16 23.88,50.16 21.34,52.7 20.07,52.7 18.8,52.7 17.53,52.7 22.61,52.7 23.88,52.7 21.34,51.44 20.07,51.44 18.8,51.44 17.53,51.44 22.61,51.44 23.88,51.44
  pour Bottom (no thermals): 3.3,41.27 6.22,41.27 14.48,49.53 25.4,49.53 25.4,53.34 11.68,53.34 3.3,44.96
  pour Top (no thermals): 16.76,53.34 16.76,50.04 20.7,46.1 20.7,42.04 25.91,42.04 25.91,52.83 25.4,53.34
N$11  (via drill 0.35)
  Top 0.152: v48.26,12.7 R2.2
  Bottom 0.152: REMOTE.2 48.26,7.69 v48.26,12.7
N$12  (via drill 0.35)
  Top 0.152: v50.8,12.7 R3.2
  Bottom 0.152: REMOTE.3 49.05,10.95 v50.8,12.7
N$13  (via drill 0.35)
  Top 0.152: R7.2 v53.34,12.7
  Bottom 0.152: v53.34,12.7 52.55,11.91 REMOTE.4
N$16
  Top 0.152: R11.1 36.43,65.62 36.35,65.54 36.35,65.22 36.22,65.09 35.9,65.09 DRV3.5
N$17
  Top 0.152: R10.1 36.49,68.66 DRV3.9
N$18
  Top 0.152: R12.2 37.6,67.66 DRV3.8
N$19  (via drill 0.35 pad 0.03)
  other vias: 20.32,56.9 19.05,56.9 17.78,56.9 21.59,56.9 22.86,56.9 24.13,56.9 20.32,58.17 19.05,58.17 17.78,58.17 21.59,58.17 22.86,58.17 24.13,58.17 20.32,55.63 19.05,55.63 17.78,55.63 21.59,55.63 22.86,55.63 24.13,55.63
  pour Bottom (no thermals): 3.3,66.67 6.35,66.67 14.1,58.93 25.4,58.93 25.4,54.99 11.3,54.99 3.3,62.99
  pour Top (no thermals): 20.7,66.67 25.91,66.67 25.91,55.5 25.4,54.99 17.02,54.99 17.02,58.93 20.7,62.61
N$20  (via drill 0.35 pad 0.03)
  other vias: 21.34,76.83 20.07,76.83 18.8,76.83 17.53,76.83 22.61,76.83 23.88,76.83 21.34,79.38 20.07,79.38 18.8,79.38 17.53,79.38 22.61,79.38 23.88,79.38 21.34,78.11 20.07,78.11 18.8,78.11 17.53,78.11 22.61,78.11 23.88,78.11
  pour Bottom (no thermals): 3.3,67.94 6.22,67.94 14.48,76.2 25.4,76.2 25.4,80.01 11.68,80.01 3.3,71.63
  pour Top (no thermals): 16.76,80.01 16.76,76.71 20.7,72.77 20.7,68.71 25.91,68.71 25.91,79.5 25.4,80.01
N$21
  Top 0.152: R14.1 35.58,11.43 DRV1.5
N$22
  Top 0.152: DRV1.9 37.33,15.32 R13.1
N$23
  Top 0.152: DRV1.8 38.17,14.32 R15.2
N$24  (via drill 0.35 pad 0.03)
  other vias: 20.32,3.56 19.05,3.56 17.78,3.56 21.59,3.56 22.86,3.56 24.13,3.56 20.32,4.83 19.05,4.83 17.78,4.83 21.59,4.83 22.86,4.83 24.13,4.83 20.32,2.29 19.05,2.29 17.78,2.29 21.59,2.29 22.86,2.29 24.13,2.29
  pour Bottom (no thermals): 3.3,13.34 6.35,13.34 14.1,5.59 25.4,5.59 25.4,1.65 11.3,1.65 3.3,9.65
  pour Top (no thermals): 20.7,13.34 25.91,13.34 25.91,2.16 25.4,1.65 17.02,1.65 17.02,5.59 20.7,9.27
N$25  (via drill 0.35 pad 0.03)
  other vias: 21.34,23.5 20.07,23.5 18.8,23.5 17.53,23.5 22.61,23.5 23.88,23.5 21.34,26.04 20.07,26.04 18.8,26.04 17.53,26.04 22.61,26.04 23.88,26.04 21.34,24.77 20.07,24.77 18.8,24.77 17.53,24.77 22.61,24.77 23.88,24.77
  pour Bottom (no thermals): 3.3,14.61 6.22,14.61 14.48,22.86 25.4,22.86 25.4,26.67 11.68,26.67 3.3,18.29
  pour Top (no thermals): 16.76,26.67 16.76,23.37 20.7,19.43 20.7,15.37 25.91,15.37 25.91,26.16 25.4,26.67
N$31
  Top 0.152: DRV4.5 61.52,16.62 R20.1
N$32
  Top 0.152: R19.1 63.25,11.01 63.98,11.74 63.98,12.05 64.11,12.19 64.43,12.19 DRV4.9
N$33
  Top 0.152: R21.2 64.05,13.12 64.11,13.19 64.43,13.19 DRV4.8
N$34  (via drill 0.35 pad 0.03)
  other vias: 80.01,24.38 81.28,24.38 82.55,24.38 78.74,24.38 77.47,24.38 76.2,24.38 80.01,23.11 81.28,23.11 82.55,23.11 78.74,23.11 77.47,23.11 76.2,23.11 80.01,25.65 81.28,25.65 82.55,25.65 78.74,25.65 77.47,25.65 76.2,25.65
  pour Bottom (no thermals): 97.03,14.61 93.98,14.61 86.23,22.35 74.93,22.35 74.93,26.29 89.03,26.29 97.03,18.29
  pour Top (no thermals): 79.63,14.61 74.42,14.61 74.42,25.78 74.93,26.29 83.31,26.29 83.31,22.35 79.63,18.67
N$35  (via drill 0.35 pad 0.03)
  other vias: 78.99,4.45 80.26,4.45 81.53,4.45 82.8,4.45 77.72,4.45 76.45,4.45 78.99,1.91 80.26,1.91 81.53,1.91 82.8,1.91 77.72,1.91 76.45,1.91 78.99,3.17 80.26,3.17 81.53,3.17 82.8,3.17 77.72,3.17 76.45,3.17
  pour Bottom (no thermals): 97.03,13.34 94.11,13.34 85.85,5.08 74.93,5.08 74.93,1.27 88.65,1.27 97.03,9.65
  pour Top (no thermals): 83.57,1.27 83.57,4.57 79.63,8.51 79.63,12.57 74.42,12.57 74.42,1.78 74.93,1.27
N$41
  Top 0.152: DRV5.5 64.56,44.36 64.24,44.36 63.86,44.74 R26.1
N$42
  Top 0.152: DRV5.9 64.56,39.49 64.24,39.49 63.83,39.08 R25.1
N$43
  Top 0.152: R27.2 64.72,41.19 DRV5.8
N$44  (via drill 0.35 pad 0.03)
  other vias: 80.14,51.69 81.41,51.69 82.68,51.69 78.87,51.69 77.6,51.69 76.33,51.69 80.14,50.42 81.41,50.42 82.68,50.42 78.87,50.42 77.6,50.42 76.33,50.42 80.14,52.96 81.41,52.96 82.68,52.96 78.87,52.96 77.6,52.96 76.33,52.96
  pour Bottom (no thermals): 97.16,41.91 94.11,41.91 86.36,49.66 75.06,49.66 75.06,53.59 89.15,53.59 97.16,45.59
  pour Top (no thermals): 79.76,41.91 74.55,41.91 74.55,53.09 75.06,53.59 83.44,53.59 83.44,49.66 79.76,45.97
N$45  (via drill 0.35 pad 0.03)
  other vias: 79.12,31.75 80.39,31.75 81.66,31.75 82.93,31.75 77.85,31.75 76.58,31.75 79.12,29.21 80.39,29.21 81.66,29.21 82.93,29.21 77.85,29.21 76.58,29.21 79.12,30.48 80.39,30.48 81.66,30.48 82.93,30.48 77.85,30.48 76.58,30.48
  pour Bottom (no thermals): 97.16,40.64 94.23,40.64 85.98,32.38 75.06,32.38 75.06,28.57 88.77,28.57 97.16,36.96
  pour Top (no thermals): 83.69,28.57 83.69,31.88 79.76,35.81 79.76,39.88 74.55,39.88 74.55,29.08 75.06,28.57
N$51
  Top 0.152: R32.1 61.14,70.72 DRV6.5
N$52
  Top 0.152: R31.1 61.17,66.72 DRV6.9
N$53
  Top 0.152: R33.2 64.85,67.86 DRV6.8
N$54  (via drill 0.35 pad 0.03)
  other vias: 80.14,78.49 81.41,78.49 82.68,78.49 78.87,78.49 77.6,78.49 76.33,78.49 80.14,77.22 81.41,77.22 82.68,77.22 78.87,77.22 77.6,77.22 76.33,77.22 80.14,79.76 81.41,79.76 82.68,79.76 78.87,79.76 77.6,79.76 76.33,79.76
  pour Bottom (no thermals): 97.16,68.71 94.11,68.71 86.36,76.45 75.06,76.45 75.06,80.39 89.15,80.39 97.16,72.39
  pour Top (no thermals): 79.76,68.71 74.55,68.71 74.55,79.88 75.06,80.39 83.44,80.39 83.44,76.45 79.76,72.77
N$55  (via drill 0.35 pad 0.03)
  other vias: 79.12,58.55 80.39,58.55 81.66,58.55 82.93,58.55 77.85,58.55 76.58,58.55 79.12,56.01 80.39,56.01 81.66,56.01 82.93,56.01 77.85,56.01 76.58,56.01 79.12,57.28 80.39,57.28 81.66,57.28 82.93,57.28 77.85,57.28 76.58,57.28
  pour Bottom (no thermals): 97.16,67.44 94.23,67.44 85.98,59.18 75.06,59.18 75.06,55.37 88.77,55.37 97.16,63.75
  pour Top (no thermals): 83.69,55.37 83.69,58.67 79.76,62.61 79.76,66.67 74.55,66.67 74.55,55.88 75.06,55.37
PWM_1
  Top 0.152: TEENSY.5 55.6,31.69 55.6,29.25 57.5,29.25 58.77,27.98 58.77,11.71 53.81,6.75 34.73,6.75 34.59,6.88 34.59,12.76 34.73,12.89 35.04,12.89 DRV1.7
PWM_2
  Top 0.152: DRV2.7 36.4,39.99 37.09,40.69 38.67,40.69 39.98,41.99 42.5,41.99 43.16,42.65 43.16,43.59 42.03,44.72 TEENSY.19
PWM_3
  Top 0.152: DRV3.7 35.04,66.23 34.73,66.23 34.59,66.09 34.59,55.56 TEENSY.18
PWM_4
  Top 0.152: TEENSY.6 64.86,27.79 64.86,23.65 60.44,19.23 60.44,16.34 60.57,16.2 62.97,16.2 64.11,15.05 64.43,15.05 DRV4.7
PWM_5
  Top 0.152: DRV5.7 63.23,41.92 62.37,42.78 62.37,43.48 62.24,43.62 61.35,43.62 60.47,44.49 56.56,44.49 55.9,45.15 55.9,46.09 57.03,47.22 TEENSY.11
PWM_6
  Top 0.152: TEENSY.12 57.03,51.52 55.9,52.65 55.9,64.93 59.55,68.59 64.85,68.59 DRV6.7
V+  (via drill 0.35 pad 0.03)  (18 unrouted)
  Top 0.152: DRV2.3
  Top 0.813: PS1.1 50.8,74.92 C2.+
  other vias: 27.94,87.63 27.94,86.36 27.94,85.09 27.94,83.82 27.94,82.55 29.21,87.63 29.21,86.36 29.21,85.09 29.21,83.82 29.21,82.55 30.48,87.63 30.48,86.36 30.48,85.09 30.48,83.82 30.48,82.55 31.75,87.63 31.75,86.36 31.75,85.09 31.75,83.82 31.75,82.55 33.02,87.63 33.02,86.36 33.02,85.09 33.02,83.82 33.02,82.55 67.31,87.63 67.31,86.36 67.31,85.09 67.31,83.82 67.31,82.55 68.58,87.63 68.58,86.36 68.58,85.09 68.58,83.82 68.58,82.55 69.85,87.63 69.85,86.36 69.85,85.09 69.85,83.82 69.85,82.55 71.12,87.63 71.12,86.36 71.12,85.09 71.12,83.82 71.12,82.55 72.39,87.63 72.39,86.36 72.39,85.09 72.39,83.82 72.39,82.55 27.94,88.9 29.21,88.9 30.48,88.9 31.75,88.9 33.02,88.9 67.31,88.9 68.58,88.9 69.85,88.9 71.12,88.9 72.39,88.9
  pour Top (isolate 0.305, rank 2, no thermals): 26.67,8.89 34.29,8.89 34.29,90.17 26.67,90.17
  pour Top (isolate 0.305, rank 2, no thermals): 73.66,8.38 66.04,8.38 66.04,90.17 73.66,90.17
  pour Bottom (isolate 0.305, rank 2, no thermals): 2.54,90.17 99.06,90.17 99.06,81.28 2.54,81.28

### Text on the board
tValues: GND | V+